# EAGLE design Mini-RS485_RJ45-MySens-v05 (EAGLE 8.5.1)
MAPLE-CUx Large Version
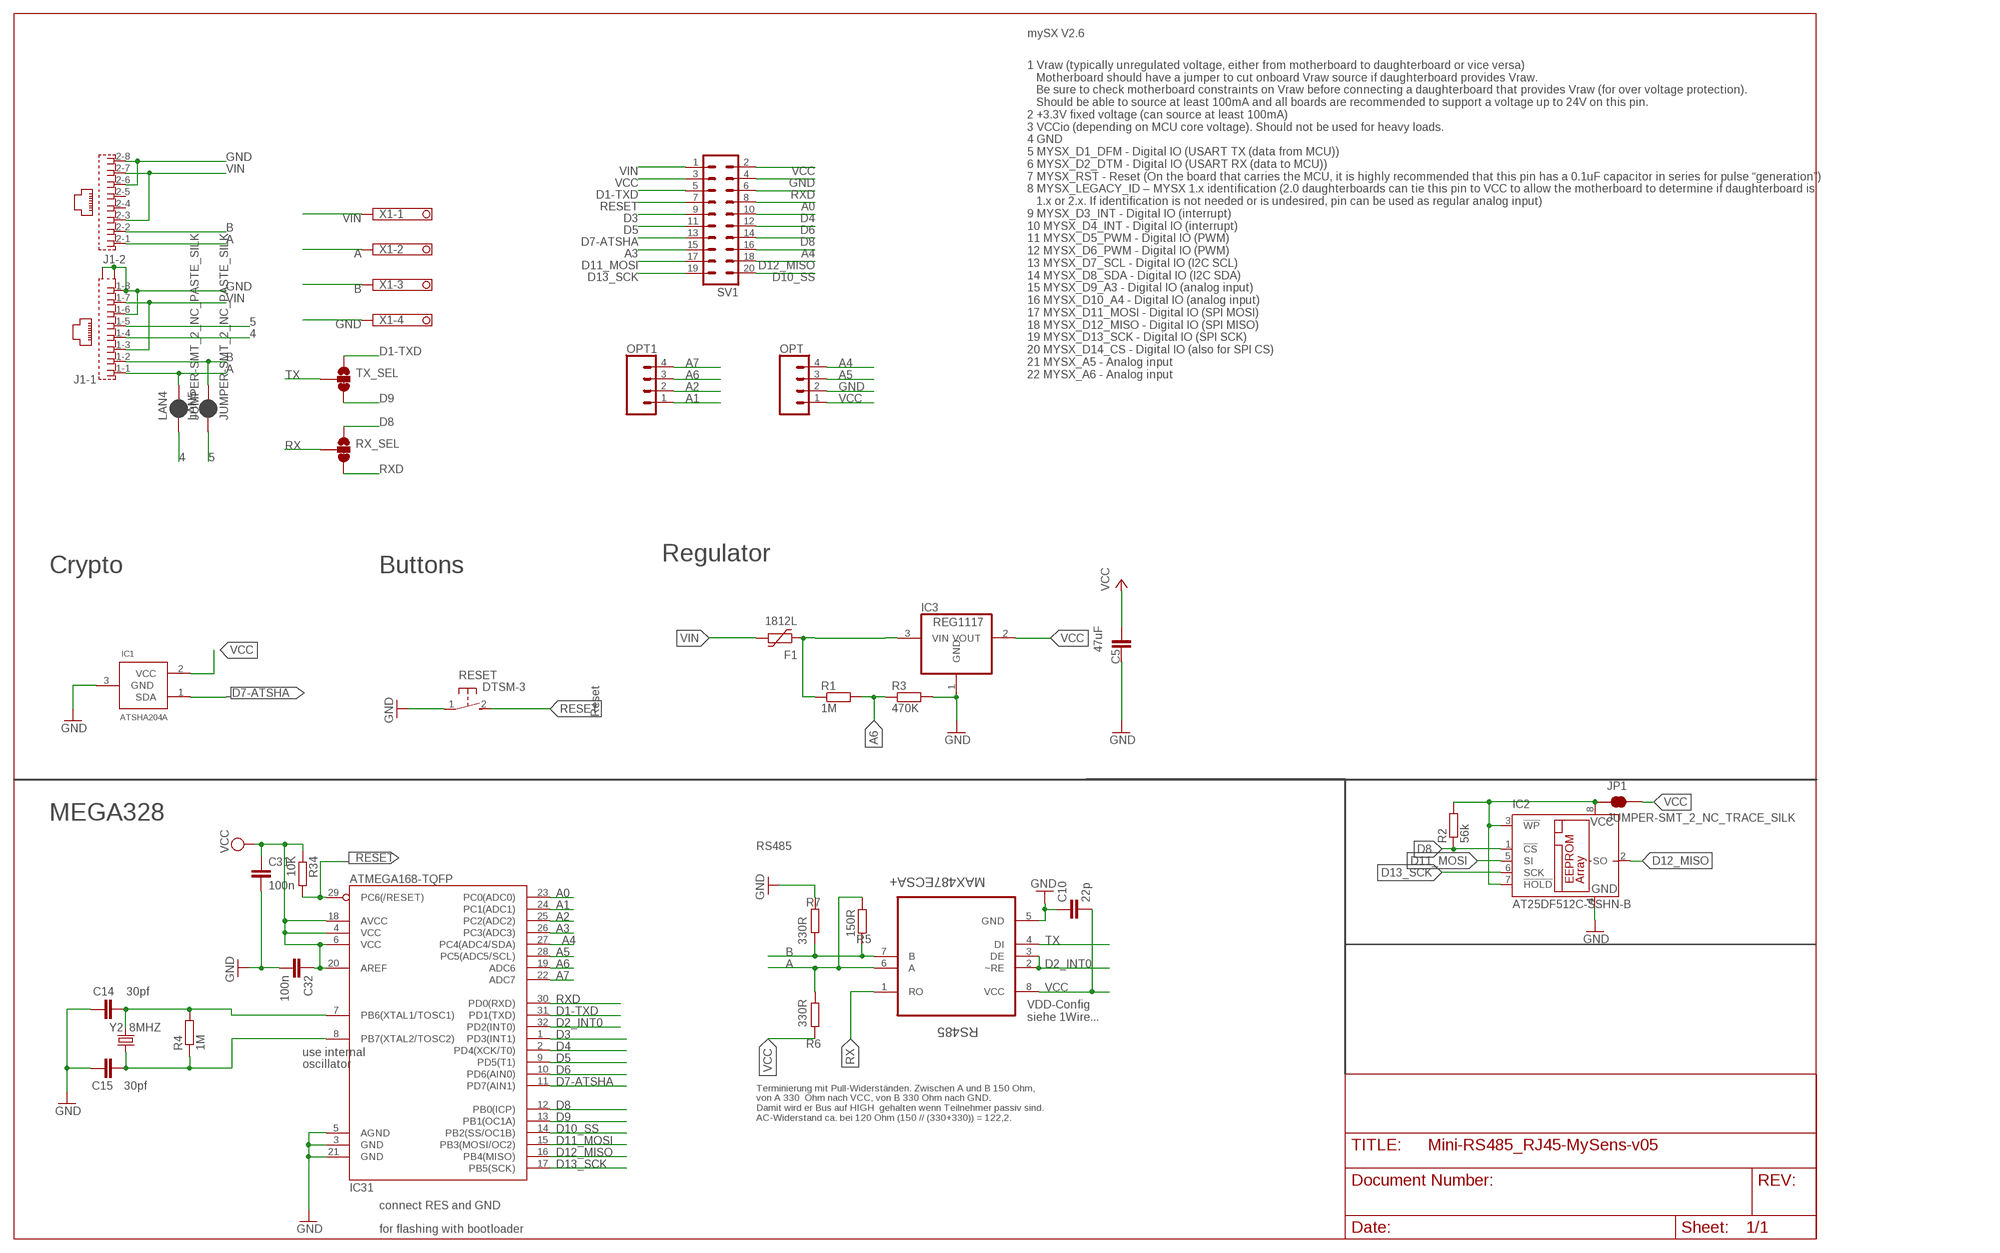
[diagram p0: schematic, sheet 1]

## Parts
C5  47uF  C-EUC1210  [C1210]
C10  22p  C-EUC0805  [C0805]
C14  30pf  CAP0805  [0805]
C15  30pf  CAP0805  [0805]
C31  100n  C-EUC0805  [C0805]
C32  100n  C-EUC0805  [C0805]
F1  1812L  [1812L]
IC1  ATSHA204A  [SOT23]
IC2  AT25DF512C-SSHN-B  25AA080SN  [SO-08]
IC3  REG1117  [SOT223]
IC31  ATMEGA168-TQFP  [TQFP32-08]
J1  RJ45_2X_NARROW_SHILDPINS  [RJ45_2X_NARROW_SHILDPINS]
JP1  JUMPER-SMT_2_NC_TRACE_SILK  [SMT-JUMPER_2_NC_TRACE_SILK]
LAN4  JUMPER-SMT_2_NC_PASTE_SILK  [SMT-JUMPER_2_NC_PASTE_SILK]
LAN5  JUMPER-SMT_2_NC_PASTE_SILK  [SMT-JUMPER_2_NC_PASTE_SILK]
OPT  CONN_04  [1X04]
OPT1  CONN_04  [1X04]
R1  1M  R-EU_M0805  [M0805]
R2  56k  R-EU_M0805  [M0805]
R3  470K  R-EU_R0805  [R0805]
R4  1M  R-EU_M0805  [M0805]
R5  150R  R-EU_R0805  [R0805]
R6  330R  R-EU_R0805  [R0805]
R7  330R  R-EU_R0805  [R0805]
R34  10K  R-EU_R0805  [R0805]
RESET  DTSM-3  [DTSM-3]
RS485  MAX487ECSA+  [SOIC127P600X175-8N]
RX_SEL  JUMPER-SMT_3_1-NC_TRACE_SILK  [SMT-JUMPER_3_1-NC_TRACE_SILK]
SV1  MA10-2  [MA10-2]
TX_SEL  JUMPER-SMT_3_1-NC_TRACE_SILK  [SMT-JUMPER_3_1-NC_TRACE_SILK]
X1  1751264  [1751264]
Y2  8MHZ  CRYSTALTXC-7A  [CRYSTAL-TXC-7A]

## Nets
4: J1.1-4 LAN4.1
5: J1.1-5 LAN5.1
A: J1.1-1 J1.2-1 LAN4.2 R5.1 R6.2 RS485.6(A) X1.2
A0: IC31.23(PC0(ADC0)) SV1.8
A1: IC31.24(PC1(ADC1)) OPT1.1
A2: IC31.25(PC2(ADC2)) OPT1.2
A3: IC31.26(PC3(ADC3)) SV1.15
A4: IC31.27(PC4(ADC4/SDA)) OPT.4 SV1.16
A5: IC31.28(PC5(ADC5/SCL)) OPT.3
A6: IC31.19(ADC6) OPT1.3 R1.2 R3.1
A7: IC31.22(ADC7) OPT1.4
B: J1.1-2 J1.2-2 LAN5.2 R5.2 R7.1 RS485.7(B) X1.3
D1-TXD: IC31.31(PD1(TXD)) SV1.5 TX_SEL.1
D2_INT0: IC31.32(PD2(INT0)) RS485.2(~RE) RS485.3(DE)
D3: IC31.1(PD3(INT1)) SV1.9
D4: IC31.2(PD4(XCK/T0)) SV1.10
D5: IC31.9(PD5(T1)) SV1.11
D6: IC31.10(PD6(AIN0)) SV1.12
D7-ATSHA: IC1.1(SDA) IC31.11(PD7(AIN1)) SV1.13
D8: IC2.1(!CS) IC31.12(PB0(ICP)) R2.1 RX_SEL.1 SV1.14
D9: IC31.13(PB1(OC1A)) TX_SEL.3
D10_SS: IC31.14(PB2(SS/OC1B)) SV1.20
D11_MOSI: IC2.5(SI) IC31.15(PB3(MOSI/OC2)) SV1.17
D12_MISO: IC2.2(SO) IC31.16(PB4(MISO)) SV1.18
D13_SCK: IC2.6(SCK) IC31.17(PB5(SCK)) SV1.19
GND [PWR]: C5.1 C10.1 C14.1 C15.1 C31.2 C32.2 IC1.3(GND) IC2.4(GND) IC3.1(GND) IC31.3(GND) IC31.5(AGND) IC31.21(GND) J1.1-6 J1.1-8 J1.2-6 J1.2-8 J1.G1(-1:S1) J1.G3(-1:S2) OPT.2 R3.2 R7.2 RESET.1 RS485.5(GND) SV1.4 X1.4
N$3: C14.2 IC31.7(PB6(XTAL1/TOSC1)) R4.2 Y2.P$2
N$19: C15.2 IC31.8(PB7(XTAL2/TOSC2)) R4.1 Y2.P$1
RESET: IC31.29(PC6(/RESET)) R34.2 RESET.2 SV1.7
RX: RS485.1(RO) RX_SEL.2
RXD: IC31.30(PD0(RXD)) RX_SEL.3 SV1.6
TX: RS485.4(DI) TX_SEL.2
VCC [PWR]: C5.2 C10.2 C31.1 C32.1 IC1.2(VCC) IC3.2(VOUT) IC31.4(VCC) IC31.6(VCC) IC31.18(AVCC) IC31.20(AREF) JP1.2 OPT.1 R6.1 R34.1 RS485.8(VCC) SV1.2 SV1.3
VCC1 [PWR]: IC2.3(!WP) IC2.7(!HOLD) IC2.8(VCC) JP1.1 R2.2
VIN [PWR]: F1.P$2 J1.1-3 J1.1-7 J1.2-3 J1.2-7 SV1.1 X1.1
VIN-FUSED [PWR]: F1.P$1 IC3.3(VIN) R1.1
Unconnected: J1.2-4 J1.2-5

## Notes on the sheet
- mySX V2.6
- 1 Vraw (typically unregulated voltage, either from motherboard to daughterboard or vice versa)
     Motherboard should have a jumper to cut onboard Vraw source if daughterboard provides Vraw. 
     Be sure to check motherboard constraints on Vraw before connecting a daughterboard that provides Vraw (for over voltage protection). 
     Should be able to source at least 100mA and all boards are recommended to support a voltage up to 24V on this pin.
  2 +3.3V fixed voltage (can source at least 100mA)
  3 VCCio (depending on MCU core voltage). Should not be used for heavy loads.
  4 GND
  5 MYSX_D1_DFM - Digital IO (USART TX (data from MCU))
  6 MYSX_D2_DTM - Digital IO (USART RX (data to MCU))
  7 MYSX_RST - Reset (On the board that carries the MCU, it is highly recommended that this pin has a 0.1uF capacitor in series for pulse “generation”)
  8 MYSX_LEGACY_ID – MYSX 1.x identification (2.0 daughterboards can tie this pin to VCC to allow the motherboard to determine if daughterboard is 
     1.x or 2.x. If identification is not needed or is undesired, pin can be used as regular analog input)
  9 MYSX_D3_INT - Digital IO (interrupt)
  10 MYSX_D4_INT - Digital IO (interrupt)
  11 MYSX_D5_PWM - Digital IO (PWM)
  12 MYSX_D6_PWM - Digital IO (PWM)
  13 MYSX_D7_SCL - Digital IO (I2C SCL)
  14 MYSX_D8_SDA - Digital IO (I2C SDA)
  15 MYSX_D9_A3 - Digital IO (analog input)
  16 MYSX_D10_A4 - Digital IO (analog input)
  17 MYSX_D11_MOSI - Digital IO (SPI MOSI)
  18 MYSX_D12_MISO - Digital IO (SPI MISO)
  19 MYSX_D13_SCK - Digital IO (SPI SCK)
  20 MYSX_D14_CS - Digital IO (also for SPI CS)
  21 MYSX_A5 - Analog input
  22 MYSX_A6 - Analog input
- Regulator
- Crypto | Buttons
- Reset
- MEGA328
- RS485
- VDD-Config
  siehe 1Wire...
- use internal
- oscillator
- Terminierung mit Pull-Widerständen. Zwischen A und B 150 Ohm,
  von A 330  Ohm nach VCC, von B 330 Ohm nach GND. 
  Damit wird er Bus auf HIGH  gehalten wenn Teilnehmer passiv sind.
  AC-Widerstand ca. bei 120 Ohm (150 // (330+330)) = 122,2.
- connect RES and GND
- for flashing with bootloader

## Library data of the parts
C5 C10 C31 C32 = rcl:C-EU: CAPACITOR, European symbol
C14 C15 = doug:CAP: Capacitor Standard 0603 ceramic capacitor, and 0.1" leaded capacitor.
F1 = ptc-littlefuse:1812L
IC1 = Sensor:ATSHA204A
IC2 = microchip:25*: Serial EEPROM 4K/ 8K , SPI bus; MF: MICROCHIP; MPN: 25AA080/SN; OC_FARNELL: 1816072; OC_NEWARK: 92C7351
IC3 = burr-brown:REG1117: 800mA and 1A Low Dropout (LDO) Positive Regulator 1.8V, 2.5V, 2.85V, 3.3V, 5V, and Adj; MPN: REG1117; OC_FARNELL: 1097566; OC_NEWARK: 14P6981
IC31 = atmel:ATMEGA168: Atmel Atmega 168/328/328P
J1 = RJ45:RJ45_2X_NARROW_SHILDPINS: RJ45 connector
JP1 = SparkFun-Jumpers:JUMPER-SMT_2_NC_TRACE: Normally closed trace jumper This jumper has a trace between two pads so it's normally closed (NC). Use a razor knife to open the connection. For best results follow the IPC guidelines for cutting traces: Cutout at least 0.063 mm (0.005 in). Remove all loose material to clean up the cut area. Seal the cut with an approved epoxy. Reapply solder to reclose the connection.
LAN4 LAN5 = SparkFun-Jumpers:JUMPER-SMT_2_NC_PASTE: Normally closed solder jumper This jumper has an aperture in the stencil to allow solder paste to bridge the split in the wire so it's normally closed (NC). Wick off the solder to open the connection. Reapply solder to reclose the connection.
OPT OPT1 = SparkFun-Connectors:CONN_04: Multi connection point. Often used as Generic Header-pin footprint for 0.1 inch spaced/style header connections On any of the 0.1 inch spaced packages, you can populate with these: Break Away Headers - Straight <https://www.sparkfun.com/products/116> (PRT-00116) Break Away Male Headers - Right Angle <https://www.sparkfun.com/products/553> (PRT-00553) Female Headers <https://www.sparkfun.com/products/115> (PRT-00115) Break Away Headers - Machine Pin <https://www.sparkfun.com/products/117> (PRT-00117) Break Away Female Headers - Swiss Machine Pin <https://www.sparkfun.com/products/743> (PRT-00743) For SCREWTERMINALS and SPRING TERMINALS visit here: Screw Terimnals on SparkFun.com <https://www.sparkfun.com/search/results?term=Screw+Terminals> (5mm/3.5mm/2.54mm spacing) This device is also useful as a general connection point to wire up your design to another part of your project. Our various solder wires solder well into these plated through hole pads. Hook-Up Wire - Assortment (Stranded, 22 AWG) <https://www.sparkfun.com/products/11375> (PRT-11375) Hook-Up Wire - Assortment (Solid Core, 22 AWG) <https://www.sparkfun.com/products/11367> (PRT-11367) View the entire wire category on our website here <https://www.sparkfun.com/categories/141> Special notes: Molex polarized connector foot print use with SKU : PRT-08231 with associated crimp pins and housings. 1MM SMD Version SKU: PRT-10208; PROD_ID: CONN-09696
R1 R3-R7 R34 = rcl:R-EU_: RESISTOR, European symbol
R2 = resistor:R-EU_: RESISTOR, European symbol
RESET = mechanics:DTSM-3: Diptronics SMD button 6x3.5 mm
RS485 = Maxim_By_element14_Batch_1:MAX487ECSA+: Low-Power, Slew-Rate-Limited RS-485/RS-422 Transceivers; MPN: MAX487ECSA+; OC_FARNELL: 9724532; OC_NEWARK: 68K4803; PACKAGE: SOIC-8; SUPPLIER: Maxim
RX_SEL TX_SEL = SparkFun-Jumpers:JUMPER-SMT_3_1-NC_TRACE: Normally closed trace jumper (1 of 2 connections) This jumper has a trace between two pads so it's normally closed (NC). The other connection is normally open (NO). Use a razor knife to open the connection. For best results follow the IPC guidelines for cutting traces: Cutout at least 0.063 mm (0.005 in). Remove all loose material to clean up the cut area. Seal the cut with an approved epoxy. Reapply solder to reclose the connection, or to close the NO connection.
SV1 = con-lstb:MA10-2: PIN HEADER; OC_FARNELL: unknown; OC_NEWARK: unknown
X1 = con-phoenix-350:1751264: MKDS 1/ 4-3,5 Printklemme Nennstrom: 10 A Bemessungsspannung: 160 V Raster: 3,5 mm Polzahl: 4 Montageart: Löten Anschlussart: Schraubanschluss Anschlussrichtung vom Leiter zur Platine: 0° Source: http://eshop.phoenixcontact.com .. 1751264.pdf; MPN: 1751264; OC_FARNELL: unknown; OC_NEWARK: 10R0934
Y2 = SparkFun-FreqCtrl:CRYSTAL: Various standard crystals. Proven footprints.

## Net classes
0 default: width 0.254 mm, clearance 0.205 mm
1 PWR: width 0.406 mm, clearance 0.205 mm to class 0, clearance 0.205 mm

## Board
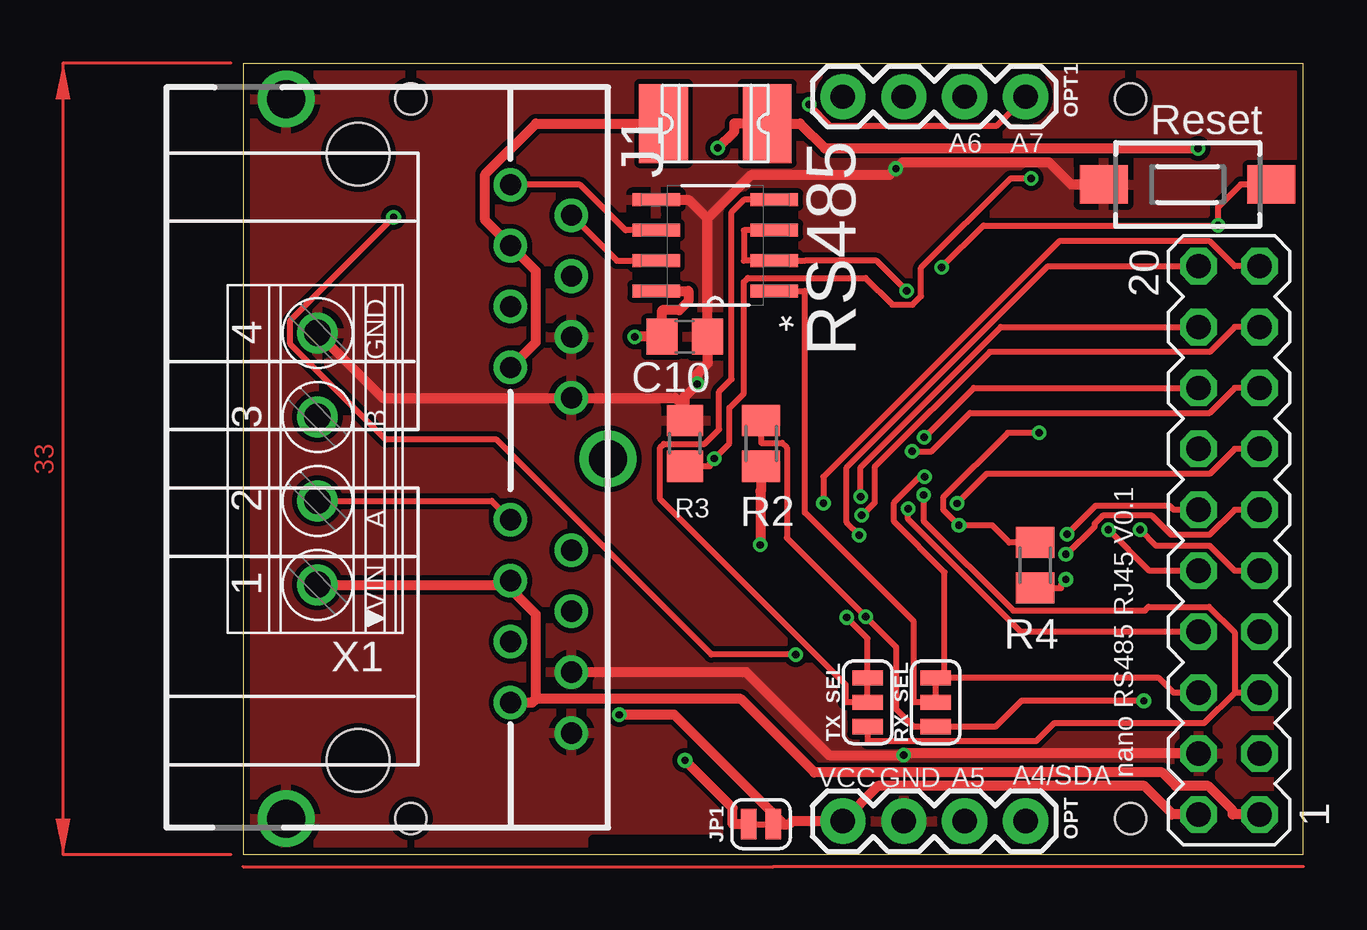
[diagram p1: board, top side]
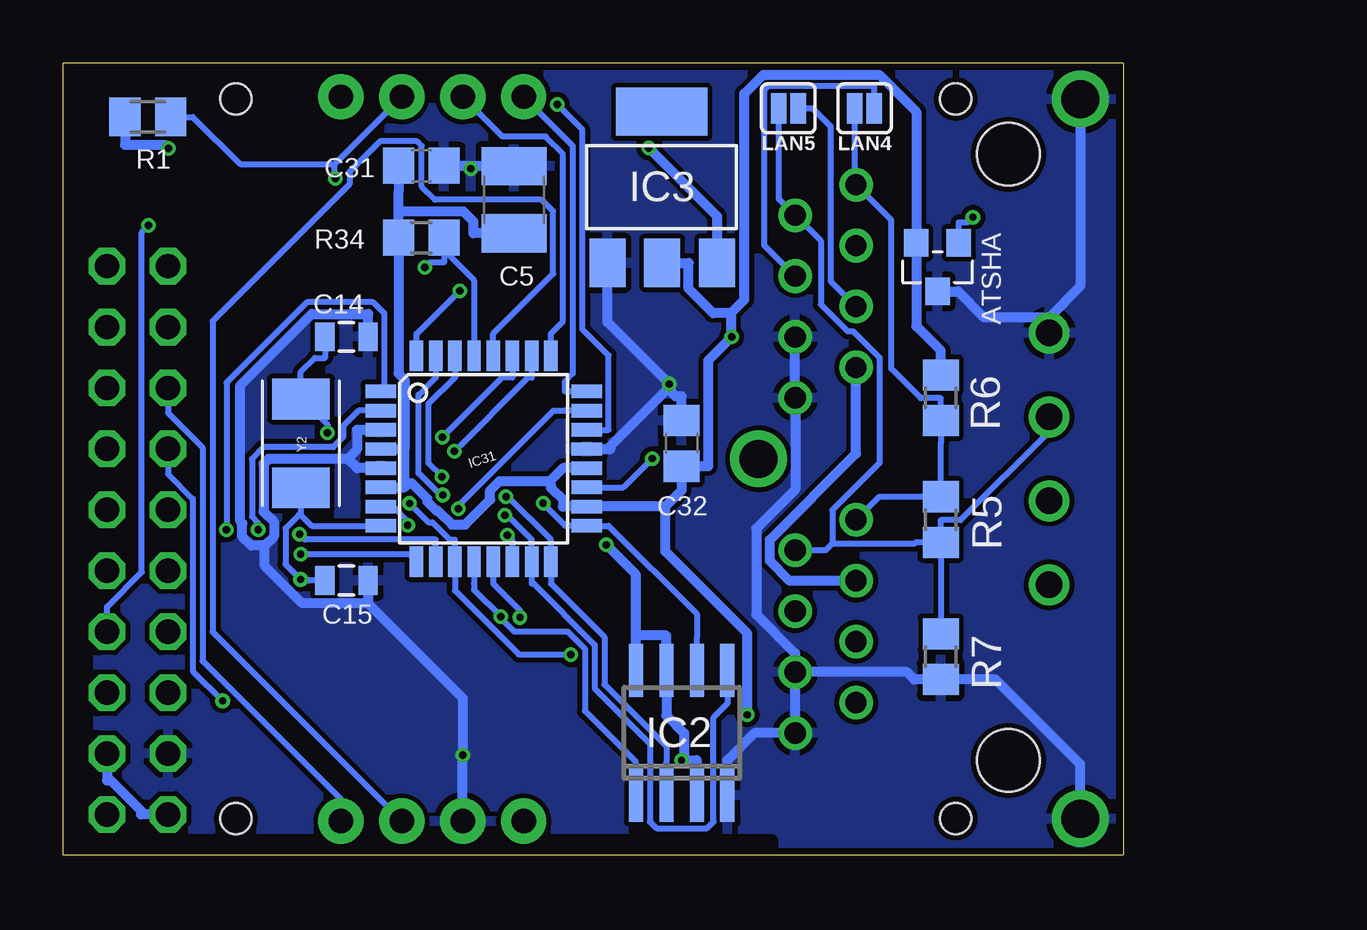
[diagram p2: board, bottom side, seen from below]

Size 44.2 x 33 mm. Coordinates in mm from the lower left corner, seen from the top.
Outline: 44.2,0 0,0 0,33 44.2,33 44.2,0
Copper layers (1*16): Top 0.035mm / dielectric 1.5mm / Bottom 0.035mm
Design rules "SeeedStudio_2layer_DRU_no_angle_20140221": minimum track width 6mil, minimum drill 12mil, track to track 6mil, track to pad 6mil, pad to pad 6mil, via to via 6mil, smd to smd 0mil, copper to edge 10mil, drill to drill 10mil, minimum pad ring 10mil, minimum via ring 6mil, stop-mask expansion 2mil, vias tented up to drill 100mil, thermal gap 10mil
Holes 1.3 mm at 37,31.5 37,1.5 7,1.5 7,31.5
tRestrict: area 43.2,0 to 43.8,26; area 14.6,0 to 43.8,0.6
bRestrict: area 43.2,0 to 43.8,26; area 14.6,0 to 43.8,0.6

### Footprints (pad centres in the part's own frame; a part is rotated, then mirrored left to right if it is on the bottom)
C1210 = smd 1.6 x 2.7: 1 -1.4,0; 2 1.4,0
C0805 = smd 1.3 x 1.5: 1 -0.95,0; 2 0.95,0
0805 = smd 0.8 x 1.2: 1 -0.9,0; 2 0.9,0
1812L = smd 2.03 x 3.3: P$1 -2.16,0; P$2 2.16,0
SOT23 = smd 1.016 x 1.143: 1 -0.889,-1.016; 2 0.889,-1.016; 3 0,1.016
SO-08 = smd 0.6 x 2.2: 1 -1.905,-2.6; 2 -0.635,-2.6; 3 0.635,-2.6; 4 1.905,-2.6; 5 1.905,2.6; 6 0.635,2.6; 7 -0.635,2.6; 8 -1.905,2.6
SOT223 = smd 1.499 x 2.007: 1 -2.261,-3.15; 2 0.025,-3.15; 3 2.311,-3.15 | smd 3.81 x 2.007: 4 0,3.15
TQFP32-08 = smd 1.27 x 0.559: 1 -4.293,2.8; 2 -4.293,2; 3 -4.293,1.2; 4 -4.293,0.4; 5 -4.293,-0.4; 6 -4.293,-1.2; 7 -4.293,-2; 8 -4.293,-2.8; 17 4.293,-2.8; 18 4.293,-2; 19 4.293,-1.2; 20 4.293,-0.4; 21 4.293,0.4; 22 4.293,1.2; 23 4.293,2; 24 4.293,2.8 | smd 0.559 x 1.27: 9 -2.8,-4.293; 10 -2,-4.293; 11 -1.2,-4.293; 12 -0.4,-4.293; 13 0.4,-4.293; 14 1.2,-4.293; 15 2,-4.293; 16 2.8,-4.293; 25 2.8,4.293; 26 2,4.293; 27 1.2,4.293; 28 0.4,4.293; 29 -0.4,4.293; 30 -1.2,4.293; 31 -2,4.293; 32 -2.8,4.293
RJ45_2X_NARROW_SHILDPINS = drill 0.889: 1-1 -11.43,6.35; 1-2 -10.16,8.89; 1-3 -8.89,6.35; 1-4 -7.62,8.89; 1-5 -6.35,6.35; 1-6 -5.08,8.89; 1-7 -3.81,6.35; 1-8 -2.54,8.89; 2-1 2.54,6.35; 2-2 3.81,8.89; 2-3 5.08,6.35; 2-4 6.35,8.89; 2-5 7.62,6.35; 2-6 8.89,8.89; 2-7 10.16,6.35; 2-8 11.43,8.89 | drill 1.575 pad 2.184: G1 -15,-3; G2 0,10.414; G3 15,-3 | hole 2.6: -12.7,0; 12.573,0
SMT-JUMPER_2_NC_TRACE_SILK = smd 0.635 x 1.27: 1 -0.508,0; 2 0.508,0
SMT-JUMPER_2_NC_PASTE_SILK = smd 0.635 x 1.27: 1 -0.406,0; 2 0.406,0
1X04 = drill 1.016 pad 1.88: 1 0,0; 2 2.54,0; 3 5.08,0; 4 7.62,0
M0805 = smd 1.3 x 1.6: 1 -0.95,0; 2 0.95,0
R0805 = smd 1.3 x 1.5: 1 -0.95,0; 2 0.95,0
DTSM-3 = smd 2 x 1.6: 1 -3.494,0; 2 3.494,0
SOIC127P600X175-8N = smd 1.981 x 0.533: 1 -2.464,1.905; 2 -2.464,0.635; 3 -2.464,-0.635; 4 -2.464,-1.905; 5 2.464,-1.905; 6 2.464,-0.635; 7 2.464,0.635; 8 2.464,1.905
SMT-JUMPER_3_1-NC_TRACE_SILK = smd 0.635 x 1.27: 1 -1.016,0; 2 0,0; 3 1.016,0
MA10-2 = drill 1.016 octagon: 1 -11.43,-1.27; 2 -11.43,1.27; 3 -8.89,-1.27; 4 -8.89,1.27; 5 -6.35,-1.27; 6 -6.35,1.27; 7 -3.81,-1.27; 8 -3.81,1.27; 9 -1.27,-1.27; 10 -1.27,1.27; 11 1.27,-1.27; 12 1.27,1.27; 13 3.81,-1.27; 14 3.81,1.27; 15 6.35,-1.27; 16 6.35,1.27; 17 8.89,-1.27; 18 8.89,1.27; 19 11.43,-1.27; 20 11.43,1.27
1751264 = drill 1.1 pad 1.7: 1 -5.25,-0.1; 2 -1.75,-0.1; 3 1.75,-0.1; 4 5.25,-0.1
CRYSTAL-TXC-7A = smd 1.7 x 2.4: P$1 1.85,0; P$2 -1.85,0

### Placement (x,y rotation side)
C5  25.4,27.3 270 bottom
C10  18.41,21.59 180 top
C14  32.38,21.59 180 bottom
C15  32.38,11.43 180 bottom
C31  29.27,28.71 0 bottom
C32  18.41,17.14 90 bottom
F1  19.68,30.48 180 top
IC1  7.75,24.49 180 bottom
IC2  18.41,5.08 0 bottom
IC3  19.25,27.82 0 bottom
IC31  26.67,16.51 0 bottom
J1  4.8,16.5 270 top
JP1  21.59,1.27 0 top
LAN4  10.79,31.11 180 bottom
LAN5  13.97,31.11 180 bottom
OPT  25,1.4 0 top
OPT1  25,31.6 0 top
R1  40.67,30.75 0 bottom
R2  21.59,17.14 270 top
R3  18.41,17.14 90 top
R4  33.02,12.06 90 top
R5  7.62,13.97 270 bottom
R6  7.62,19.05 270 bottom
R7  7.62,8.26 270 bottom
R34  29.27,25.71 0 bottom
RESET  39.37,27.94 0 top
RS485  19.68,25.4 180 top
RX_SEL  28.87,6.35 90 top
SV1  41.1,13.11 90 top
TX_SEL  26.04,6.35 90 top
X1  3,16.5 90 top
Y2  34.29,17.14 270 bottom

### Tracks (layer width: path | path; a pad name or v marks a point on that pad's centre or on a via)
4
  Bottom 0.254: LAN4.1 10.39,32.03 14.81,32.03 14.98,31.86 14.98,25.41 J1.1-4
5
  Bottom 0.254: LAN5.1 12.97,31.11 12.21,30.36 12.21,23.91 J1.1-5
A
  Top 0.254: X1.2 10.36,14.75 J1.2-1 | RS485.6 15.95,26.04 14.06,27.93 J1.1-1
  Bottom 0.254: LAN4.2 11.2,27.98 J1.1-1 9.68,26.46 9.68,20.26 8.45,19.03 7.62,19.03 R6.2 7.62,17.17 R5.1 10.19,14.92 J1.2-1
A0  (via drill 0.3 pad 0.61)
  Top 0.254: v27.72,14.42 27.72,13.99 32.42,9.29 38.79,9.29 SV1.8
  Bottom 0.254: v27.72,14.42 27.72,14.55 23.76,18.51 23.29,18.51 IC31.23
A1
  Bottom 0.254: IC31.24 23.29,19.31 23.29,19.71 22.96,20.05 22.96,29.56 OPT1.1
A2
  Bottom 0.254: OPT1.2 25.88,29.94 24.09,29.94 23.36,29.21 23.36,22.23 23.87,21.72 IC31.25
A3  (via drill 0.3 pad 0.61)
  Top 0.254: v27.89,16.81 28.7,16.81 30.3,18.41 40.29,18.41 41.33,19.45 SV1.15
  Bottom 0.254: v27.89,16.81 24.81,19.89 24.67,19.89 IC31.26
A4  (via drill 0.3 pad 0.61)
  Top 0.254: v28.4,17.4 30.45,19.45 SV1.16
  Bottom 0.254: OPT.4 32.62,2.31 38.38,8.07 38.38,16.97 39.83,18.41 SV1.16 | v28.4,17.4 25.91,19.89 25.47,19.89 IC31.27
A5
  Bottom 0.254: OPT.3 37.98,9.3 37.98,22.24 32.26,27.95 32.26,28.47 30.99,29.74 29.45,29.74 29.25,29.55 29.25,27.85 28.7,27.3 24.25,27.3 23.77,26.82 23.77,24.22 26.27,21.72 IC31.28
A6  (via drill 0.3 pad 0.61)
  Top 0.254: v32.85,28.2 32,28.2 28.27,24.46 28.27,23.29 27.91,22.93 27.07,22.93 25.95,24.04 21.04,24.04 20.88,23.88 20.88,19.23 20.27,18.62 20.27,17.14 v19.64,16.51 19.44,16.32 19.44,16.2 R3.1
  Bottom 0.254: 32.89,28.79 36.83,28.79 38.79,30.75 R1.2 | 32.89,28.79 OPT1.3 | v32.85,28.2 32.89,28.24 32.89,28.79 | IC31.19 20.84,15.31 v19.64,16.51
A7  (via drill 0.3 pad 0.61)
  Top 0.254: OPT1.4 31.4,30.38 24.49,30.38 v23.6,31.27
  Bottom 0.254: IC31.22 21.46,17.71 21.46,20.81 22.55,21.9 22.55,30.22 v23.6,31.27
B
  Top 0.254: J1.1-2 15.59,24.77 RS485.7
  Bottom 0.254: R5.2 7.62,13.95 6.79,13.95 3.1,17.64 X1.3 | 12.13,12.98 12.42,12.69 J1.2-2 | 12.13,12.98 12.13,14.37 10.17,16.34 10.17,20.71 11.27,21.82 11.51,21.82 12.62,22.94 12.62,25.59 J1.1-2 14.38,27.35 LAN5.2 | 12.13,12.98 8.69,12.98 8.65,13.02 R5.2 | R5.2 R7.1
D1-TXD  (via drill 0.3 pad 0.61)
  Top 0.254: v28.37,15 28.37,13.92 32.11,10.18 37.59,10.18 37.74,10.34 40.26,10.34 41.33,9.27 41.33,6.75 | 41.33,6.75 41.43,6.75 SV1.5 | TX_SEL.1 26.04,4.74 33.06,4.74 33.81,5.49 40.06,5.49 41.33,6.75
  Bottom 0.254: v28.37,15 28.48,15 29.39,15.91 29.39,19.17 28.67,19.89 IC31.31
D2_INT0  (via drill 0.3 pad 0.61)
  Top 0.254: v27.66,23.51 26.4,24.77 23.42,24.77 RS485.2 20.88,24.77 20.88,26.04 RS485.3
  Bottom 0.254: IC31.32 29.47,21.72 29.45,21.72 v27.66,23.51
D3  (via drill 0.3 pad 0.61)
  Top 0.254: v37.39,13.54 38.06,12.88 40.29,12.88 41.33,11.84 SV1.9
  Bottom 0.254: IC31.1 30.81,19.47 30.81,22.55 31.28,23.03 34.03,23.03 37.39,19.67 v37.39,13.54
D4  (via drill 0.3 pad 0.61)
  Top 0.254: 38.79,11.84 | 38.79,11.84 37.78,11.84 v36.07,13.55 | SV1.10 38.79,11.84
  Bottom 0.254: v36.07,13.55 36.07,13.84 36.33,14.1 36.33,16.5 35.83,16.99 32.94,16.99 32.52,17.41 32.52,17.86 31.88,18.51 IC31.2
D5  (via drill 0.3 pad 0.61)
  Top 0.254: v34.3,12.53 34.35,12.53 35.49,13.67 35.49,13.79 35.83,14.13 37.89,14.13 38.69,13.33 40.28,13.33 41.33,14.38 SV1.11
  Bottom 0.254: v34.3,12.53 29.78,12.53 IC31.9
D6  (via drill 0.3 pad 0.61)
  Top 0.254: v34.34,13.36 35.53,14.54 38.62,14.54 38.79,14.38 SV1.12
  Bottom 0.254: v34.34,13.36 34.12,13.13 28.67,13.13 IC31.10
D7-ATSHA  (via drill 0.3 pad 0.61)
  Top 0.254: v23.03,8.34 19.52,8.34 10.57,17.3 5.95,17.3 1.97,21.28 1.97,22.27 v6.28,26.57 | SV1.13 41.33,16.91 40.29,15.87 30.99,15.87 v29.76,14.64
  Bottom 0.254: IC1.1 6.86,26.36 6.49,26.36 v6.28,26.57 | v23.03,8.34 25.2,8.34 27.87,11.01 IC31.11 27.87,12.57 27.87,13.13 28.09,13.13 28.81,13.85 28.97,13.85 v29.76,14.64
D8  (via drill 0.3 pad 0.61)
  Top 0.254: v37.55,6.41 32.45,6.41 31.37,5.33 RX_SEL.1 27.96,5.33 27.23,6.06 27.23,8.64 v25.95,9.92 v25.95,9.93 22.67,13.21 22.67,16.96 22.47,17.17 21.59,17.17 R2.1
  Bottom 0.254: SV1.14 39.83,15.87 38.79,14.83 38.79,7.65 v37.55,6.41 | IC2.1 20.32,3.86 22.45,5.99 22.45,8.59 23.17,9.31 25.4,9.31 25.95,9.86 v25.95,9.92 27.07,11.04 27.07,11.3 IC31.12
D9  (via drill 0.3 pad 0.61)
  Top 0.254: TX_SEL.3 26.04,9.01 v25.16,9.89
  Bottom 0.254: v25.16,9.89 25.16,10.19 26.27,11.3 IC31.13
D10_SS  (via drill 0.3 pad 0.61)
  Top 0.254: v25.68,13.32 25.16,13.85 25.16,16.14 33.55,24.54 SV1.20
  Bottom 0.254: v25.68,13.32 25.5,13.13 25.47,13.13 IC31.14
D11_MOSI  (via drill 0.3 pad 0.61)
  Top 0.254: 40.29,20.95 41.33,22 SV1.17 | 40.29,20.95 | 40.29,20.95 31.12,20.95 26.32,16.16 26.32,14.66 25.81,14.15 v25.79,14.15
  Bottom 0.254: v25.79,14.15 25.68,14.15 24.67,13.14 24.67,13.03 24.67,12.62 IC31.15 24.67,11.3 24.59,11.3 22.04,8.76 22.04,6.93 19.74,4.63 19.74,1.37 19.47,1.1 17.36,1.1 17.09,1.37 17.09,5.72 16.51,6.3 IC2.5
D12_MISO  (via drill 0.3 pad 0.61)
  Top 0.254: v25.74,14.92 25.74,16.15 31.59,22 SV1.18
  Bottom 0.254: v25.74,14.92 25.66,14.92 23.87,13.13 IC31.16 23.87,11.3 21.64,9.07 21.64,7.1 19.05,4.51 19.05,3.86 IC2.2
D13_SCK  (via drill 0.3 pad 0.61)
  Top 0.254: SV1.19 41.33,24.54 40.29,25.58 34.02,25.58 24.19,15.75 v24.19,14.65
  Bottom 0.254: v24.19,14.65 23.29,13.75 23.29,13.71 IC31.17 22.17,13.71 21.46,13.71 17.78,10.03 17.78,9.06 IC2.6
GND  (via drill 0.3 pad 0.61)
  Top 0.406: 19.36,26.51 21.2,28.34 26.95,28.34 v27.21,28.6 27.47,28.86 33.6,28.86 34.52,27.94 RESET.1 | 19.36,26.51 18.57,27.3 RS485.5 | 19.36,26.51 C10.1 19.36,20.48 18.93,20.05 v18.93,19.62 18.41,19.1 | X1.4 5.81,19.04 J1.1-8 18.02,19.04 18.1,18.95 18.27,18.95 18.41,19.1 | J1.2-6 20.97,7.61 24.43,4.14 v27.54,4.14 27.61,4.21 SV1.4 | R3.2 18.41,19.1
  Bottom 0.406: 35.8,12.89 36.35,12.89 36.73,13.27 36.73,13.82 36.81,13.9 36.81,19.57 33.84,22.55 31.48,22.55 C14.1 | 32.35,16.5 35.64,16.5 35.85,16.3 35.85,14.29 35.41,13.86 35.41,13.28 35.8,12.89 | 31.48,10.47 34.23,10.47 35.8,12.04 35.8,12.89 | IC2.4 16.51,3.94 15.38,5.07 J1.2-8 J1.2-6 | v27.21,28.6 v27.2,28.61 | v27.2,28.61 27.31,28.71 C31.2 | v27.2,28.61 27.11,28.7 C5.1 | 32.35,16.5 31.95,16.9 31.95,17.71 IC31.3 | 31.48,10.47 27.54,6.53 v27.54,4.14 OPT.2 | 32.35,16.5 31.95,16.11 IC31.5 | J1.2-6 13.69,8.4 15.3,10.02 15.3,13.6 13.68,15.23 13.68,19.02 J1.1-8 J1.1-6 | C15.1 31.48,10.47 | IC3.1 21.52,22.2 v18.93,19.62 18.93,19.36 | R3.2 18.41,19.1 18.67,19.1 18.93,19.36 | 18.93,19.36 19.06,19.36 21.39,17.03 21.39,16.91 IC31.21 | 3.1,22.4 5.81,22.4 6.89,23.48 IC1.3 | J1.G1 1.8,23.7 3.1,22.4 | 3.1,22.4 X1.4 | J1.G3 1.8,3.77 5.33,7.3 R7.2 8.73,7.3 9.03,7.61 J1.2-6
  pour Top: 0.5,32.5 43.8,32.5 43.8,0.5 0.5,0.5
  pour Bottom: 0.5,32.5 43.8,32.5 43.8,0.5 0.5,0.5
N$3  (via drill 0.3 pad 0.61)
  Top 0.254: v33.18,17.59 31.87,17.59 29.17,14.89 29.17,14.4 v29.84,13.73 31.23,13.73 31.94,13.02 R4.2
  Bottom 0.254: v29.84,13.73 29.84,13.9 30.45,14.51 IC31.7 | 34.29,19.03 33.18,17.92 v33.18,17.59 | 34.29,19.03 34.29,20.12 33.7,20.71 33.28,20.71 C14.2 | Y2.P$2 34.29,19.03
N$19  (via drill 0.3 pad 0.61)
  Top 0.254: R4.1 34.1,11.12 34.1,11.28 v34.3,11.47
  Bottom 0.254: 34.29,14.17 34.36,14.17 34.93,13.6 34.93,12.1 v34.3,11.47 34.01,11.47 33.96,11.43 C15.2 | Y2.P$1 34.29,14.17 | 34.29,14.17 33.83,13.71 IC31.8
RESET  (via drill 0.3 pad 0.61)
  Top 0.254: v29.12,24.48 30.86,26.23 v40.65,26.23 40.65,27 41.58,27.94 RESET.2
  Bottom 0.254: v29.12,24.48 28.92,24.69 28.32,24.69 28.32,25.2 | 28.32,25.2 27.07,23.95 IC31.29 | R34.2 28.32,25.2 | SV1.7 42.37,10.34 40.92,11.78 40.92,25.95 v40.65,26.23
RX
  Top 0.254: RS485.1 23.42,23.5 23.42,14.26 27.96,9.72 27.96,6.35 RX_SEL.2
RXD  (via drill 0.3 pad 0.61)
  Top 0.254: SV1.6 38.79,6.75 38.18,7.37 29.24,7.37 | 29.24,7.37 29.24,11.77 27.14,13.88 27.14,14.67 28.22,15.76 v28.41,15.76 | RX_SEL.3 29.24,7.37
  Bottom 0.254: v28.41,15.76 28.98,16.33 28.98,18.78 27.87,19.89 IC31.30
TX
  Top 0.254: RS485.4 20.88,27.3 20.37,26.8 20.37,19.82 19.85,19.3 19.85,17.73 19.24,17.12 17.55,17.12 17.39,16.96 17.39,14.82 25.12,7.08 25.12,6.35 TX_SEL.2
VCC  (via drill 0.3 pad 0.61)
  Top 0.406: 22.48,1.27 22.48,1.33 17.98,5.83 v15.68,5.83 | 22.48,1.27 22.77,1.27 22.9,1.4 OPT.1 26.46,2.86 37.57,2.86 38.71,1.72 38.71,1.68 SV1.2 | JP1.2 22.48,1.27 | RS485.8 18.57,23.5 18.57,23.08 18.19,22.7 17.46,22.7 C10.2 16.46,21.59 v16.33,21.59
  Bottom 0.406: 29.8,15.48 29.66,15.48 29.03,14.85 29.03,14.72 28.64,14.34 28.57,14.34 27.99,13.76 27.44,13.76 26.4,14.8 26.4,15.19 26.01,15.58 23.95,15.58 23.93,15.55 | 19.09,14.51 IC31.18 23.37,14.51 23.37,14.8 23.86,15.29 23.86,15.43 23.9,15.46 23.9,15.52 23.93,15.55 | 19.09,14.51 18.41,15.19 C32.1 17.31,16.2 17.31,20.61 v16.33,21.59 16.36,21.62 16.36,22.58 | v15.68,5.83 15.68,9.22 19.09,12.63 19.09,14.51 | 29.8,15.48 29.97,15.65 29.97,16.91 | C5.2 27.11,25.91 27.11,26.41 27.52,26.82 30.22,26.82 | 23.93,15.55 23.37,16.11 IC31.20 | R6.1 7.62,21.01 8.64,22.03 IC1.2 8.64,30.97 10.18,32.51 15.02,32.51 15.8,31.73 15.8,23.13 16.36,22.58 | 30.22,26.82 30.22,27.61 C31.1 | 30.22,26.82 R34.1 30.22,20.06 29.97,19.81 29.97,16.91 | 16.36,22.58 17.11,22.58 18.12,23.59 18.12,24.67 IC3.2 | IC31.4 29.97,16.91 | 29.8,15.48 29.97,15.31 IC31.6 | SV1.2 40.95,1.68 40.95,1.83 42.21,3.1 42.37,3.1 SV1.3
VCC1  (via drill 0.3 pad 0.61)
  Top 0.406: v21.56,12.91 21.56,15.16 21.59,15.19 R2.2 | v18.42,3.93 20.41,1.94 20.41,1.27 JP1.1
  Bottom 0.406: 20.32,9.14 20.32,11.68 v21.56,12.91 | IC2.8 20.32,9.14 | 20.32,9.14 19.05,9.14 IC2.7 19.05,5.8 18.32,5.07 18.32,4.04 | IC2.3 17.78,3.94 18.21,3.94 18.32,4.04 | 18.32,4.04 v18.42,3.93
VIN
  Top 0.406: 12.21,6.49 12.21,10.03 10.98,11.25 | J1.2-7 12.05,6.34 12.21,6.49 | 12.21,6.49 20.75,6.49 23.82,3.42 38.31,3.42 38.87,2.86 40.23,2.86 41.25,1.84 41.25,1.68 SV1.1 | J1.1-7 12.21,21.37 12.21,24.33 J1.1-3 10.1,26.45 10.1,28.37 12.21,30.48 F1.P$2 | 10.98,11.25 J1.2-3 | X1.1 10.98,11.25
  Bottom 0.406: J1.2-3 13.91,11.42 14.75,12.25 14.75,13.13 11.15,16.72 J1.1-7
VIN-FUSED  (via drill 0.3 pad 0.61)
  Top 0.406: v39.81,29.45 24.25,29.45 23.22,30.48 F1.P$1 20.47,30.48 20.47,30.15 v19.79,29.46
  Bottom 0.406: v39.81,29.45 39.96,29.59 41.62,29.59 R1.1 | v19.79,29.46 16.94,26.62 IC3.3
(copper drawn outside any net)
  shapes: Top area x2

### Text on the board
tNames: Reset | A6 | A7 | GND | B | A | R3 | VIN | VCC | GND | A5 | A4/SDA | nano RS485 RJ45 V0.1
bNames: R1 | C31 | ATSHA | R34 | C5 | C14 | C32 | C15
tDocu: 1 Vraw (typically unregulated voltage, either from motherboard to daughterboard or vice versa) Motherboard should have a jumper to cut onboard Vraw source if daughterboard provides Vraw. Be sure to check motherboard constraints on Vraw before connecting a daughterboard that provides Vraw (for over voltage protection). Should be able to source at least 100mA and all boards are recommended to support a voltage up to 24V on this pin. / 2 +3.3V fixed voltage (can source at least 100mA) / 3 VCCio (depending on MCU core voltage). Should not be used for heavy loads. / 4 GND / 5 MYSX_D1_DFM - Digital IO (USART TX (data from MCU)) / 6 MYSX_D2_DTM - Digital IO (USART RX (data to MCU)) / 7 MYSX_RST - Reset (On the board that carries the MCU, it is highly recommended that this pin has a 0.1uF capacitor in series for pulse “generation”) / 8 MYSX_LEGACY_ID – MYSX 1.x identification (2.0 daughterboards can tie this pin to VCC to allow the motherboard to determine if daughterboard is 1.x or 2.x. If identification is not needed or is undesired, pin can be used as regular analog input) / 9 MYSX_D3_INT - Digital IO (interrupt) / 10 MYSX_D4_INT - Digital IO (interrupt) / 11 MYSX_D5_PWM - Digital IO (PWM) / 12 MYSX_D6_PWM - Digital IO (PWM) / 13 MYSX_D7_SCL - Digital IO (I2C SCL) / 14 MYSX_D8_SDA - Digital IO (I2C SDA) / 15 MYSX_D9_A3 - Digital IO (analog input) / 16 MYSX_D10_A4 - Digital IO (analog input) / 17 MYSX_D11_MOSI - Digital IO (SPI MOSI) / 18 MYSX_D12_MISO - Digital IO (SPI MISO) / 19 MYSX_D13_SCK - Digital IO (SPI SCK) / 20 MYSX_D14_CS - Digital IO (also for SPI CS) / 21 MYSX_A5 - Analog input / 22 MYSX_A6 - Analog input
Name: A1 | A2 | I2C-CON